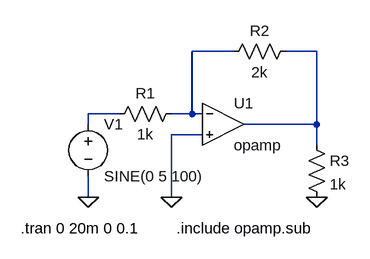
[diagram p0: schematic opamp.asc]
opamp.asc, the LTspice schematic file:
Version 4
SHEET 1 880 680
WIRE 224 48 160 48
WIRE 352 48 304 48
WIRE 48 144 0 144
WIRE 160 144 160 48
WIRE 160 144 128 144
WIRE 176 144 160 144
WIRE 0 160 0 144
WIRE 352 160 352 48
WIRE 352 160 240 160
WIRE 176 176 128 176
WIRE 352 192 352 160
WIRE 0 272 0 240
WIRE 128 272 128 176
FLAG 128 272 0
FLAG 0 272 0
FLAG 352 272 0
SYMBOL Opamps\\opamp 208 96 R0
SYMATTR InstName U1
SYMBOL res 144 128 R90
WINDOW 0 0 56 VBottom 2
WINDOW 3 32 56 VTop 2
SYMATTR InstName R1
SYMATTR Value 1k
SYMBOL voltage 0 144 R0
WINDOW 123 0 0 Left 2
WINDOW 39 0 0 Left 2
SYMATTR InstName V1
SYMATTR Value SINE(0 5 100)
SYMBOL res 320 32 R90
WINDOW 0 0 56 VBottom 2
WINDOW 3 32 56 VTop 2
SYMATTR InstName R2
SYMATTR Value 2k
SYMBOL res 336 176 R0
SYMATTR InstName R3
SYMATTR Value 1k
TEXT -104 320 Left 2 !.tran 0 20m 0 0.1
TEXT 136 320 Left 2 !.include opamp.sub

The netlist it stands for:
* opamp.asc
XU1 N001 0 N002 opamp Aol=100K GBW=10Meg  ; pins invin noninvin out
R1 N001 N003 1k
V1 N003 0 SINE(0 5 100)
R2 N002 N001 2k
R3 N002 0 1k
.tran 0 20m 0 0.1
.include opamp.sub
.backanno
.end